# Altium schematic sheet USB_CP2104.SchDoc: CP2104 USB to Serial
size A4; Author: Andrés Gullón; DocumentNumber: 3; Revision: 1.G.3; SheetNumber: 3; SheetTotal: 6
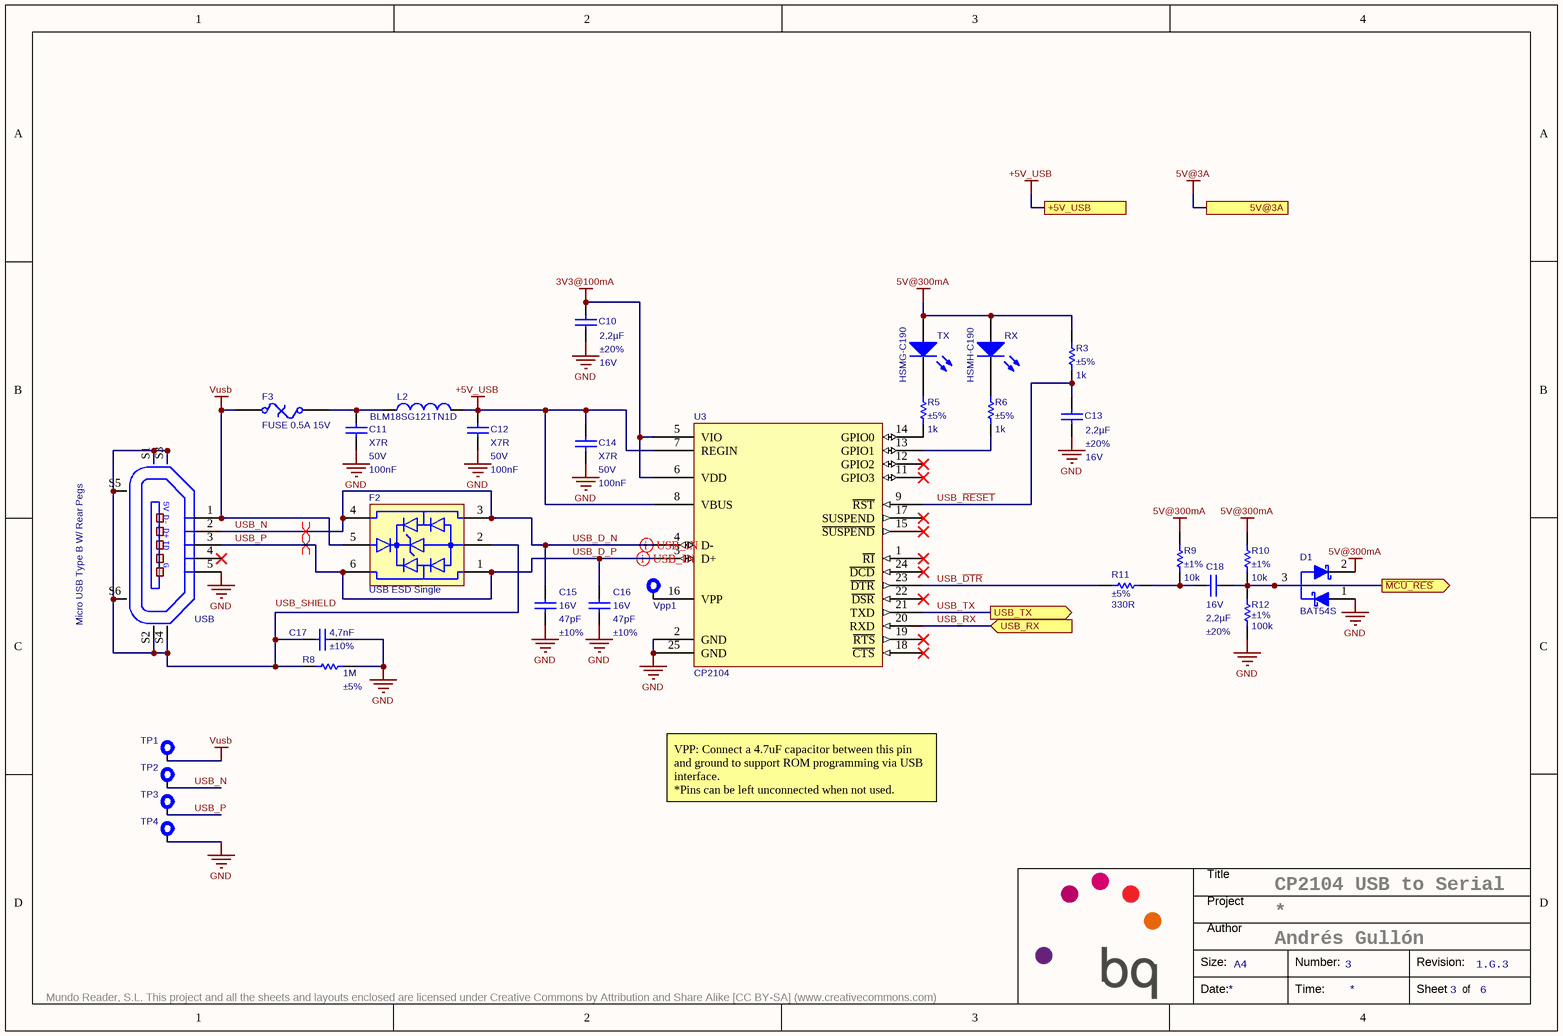
[diagram p0: USB_CP2104.SchDoc]

## Parts
C10  Voltage: 16V  Capacitance: 2,2µF  Tolerance: ±20%  [C0402]  (hidden comment: C0402_2.2uF_16V_±20%)
C11  Dielectric: X7R  Voltage: 50V  Capacitance: 100nF  [C0603]  (hidden comment: C0603_100nF_50V_±10%_X7R)
C12  Dielectric: X7R  Voltage: 50V  Capacitance: 100nF  [C0603]  (hidden comment: C0603_100nF_50V_±10%_X7R)
C13  Voltage: 16V  Capacitance: 2,2µF  Tolerance: ±20%  [C0402]  (hidden comment: C0402_2.2uF_16V_±20%)
C14  Dielectric: X7R  Voltage: 50V  Capacitance: 100nF  [C0603]  (hidden comment: C0603_100nF_50V_±10%_X7R)
C15  Voltage: 16V  Capacitance: 47pF  Tolerance: ±10%  [C0402]  (hidden comment: C0402_47pF_16V_±10%)
C16  Voltage: 16V  Capacitance: 47pF  Tolerance: ±10%  [C0402]  (hidden comment: C0402_47pF_16V_±10%)
C17  Capacitance: 4,7nF  Tolerance: ±10%  [C0805]  (hidden comment: C0805_4700pF_250V_±10%_X7R)
C18  Voltage: 16V  Capacitance: 2,2µF  Tolerance: ±20%  [C0402]  (hidden comment: C0402_2.2uF_16V_±20%)
D1  BAT54S  [SOT23-3]
F2  USB ESD Single  [SOT563]
F3  FUSE 0.5A 15V  [F1812]
L2  OrderingCode: BLM18SG121TN1D  [L0603]  (hidden comment: L0603_120R_0,025R_3000mA)
R3  Tolerance: ±5%  Resistance: 1k  [R0402]  (hidden comment: R0402_1k_0.063W_±5%)
R5  Tolerance: ±5%  Resistance: 1k  [R0402]  (hidden comment: R0402_1k_0.063W_±5%)
R6  Tolerance: ±5%  Resistance: 1k  [R0402]  (hidden comment: R0402_1k_0.063W_±5%)
R8  Tolerance: ±5%  Resistance: 1M  [R0603]  (hidden comment: R0603_1M_0.1W_±5%)
R9  Tolerance: ±1%  Resistance: 10k  [R0402]  (hidden comment: R0402_10k_0.063W_±1%)
R10  Tolerance: ±1%  Resistance: 10k  [R0402]  (hidden comment: R0402_10k_0.063W_±1%)
R11  Tolerance: ±5%  Resistance: 330R  [R0402]  (hidden comment: R0402_330R_0.063W_±5%)
R12  Tolerance: ±1%  Resistance: 100k  [R0402]  (hidden comment: R0402_100k_0.063W_±1%)
RX  HSMH-C190  [LED0603]
TP1  TP  [TP_POWER]  (value not drawn)  (no BOM)
TP2  TP_POWER  [TP_POWER]  (value not drawn)  (no BOM)
TP3  TP_POWER  [TP_POWER]  (value not drawn)  (no BOM)
TP4  TP_POWER  [TP_POWER]  (value not drawn)  (no BOM)
TX  HSMG-C190  [LED0603]
U3  CP2104  [QFN24_no_power]
USB  Micro USB Type B W/ Rear Pegs  [USB_B_W_REAR_PEGS]
Vpp1  TP_POWER  [TP_POWER]  (value not drawn)  (no BOM)

## Ports
5V@3A, +5V_USB, USB_RX (in), USB_TX (out), ~{MCU_RES} (out)

## Nets
3V3@100mA: C10.2 U3.5(VIO) U3.6(VDD)
5V@3A: port 5V@3A
5V@300mA: D1.2(K2) R3.2 R9.1 R10.1 RX.A TX.A
+5V_USB: C12.2 C14.2 L2.2 U3.7(REGIN) U3.8(VBUS) ; port +5V_USB
GND: C10.1 C11.1 C12.1 C13.1 C14.1 C15.1 C16.1 C17.2 D1.1(A) R8.1 R12.2 TP4.1 U3.2(GND) U3.25(GND) USB.5(P5)
Vusb: F2.5 F3.1 TP1.1 USB.1(P1)
~{MCU_RES}: C18.1 D1.3(K1) R10.2 R12.1 ; port ~{MCU_RES}
USB_~{DTR}: R11.1 U3.23(~{DTR})
USB_D_N: C15.2 F2.3 F2.4 TP2.1 U3.4(D-) USB.2(P2)  [also labelled USB_N]
USB_D_P: C16.2 F2.1 F2.6 TP3.1 U3.3(D+) USB.3(P3)  [also labelled USB_P]
USB_~{RESET}: C13.2 R3.1 U3.9(~{RST})
USB_RX: U3.20(RXD) ; port USB_RX
USB_TX: U3.21(TXD) ; port USB_TX
NetC11_2: C11.2 F3.2 L2.1
NetC17_1: C17.1 F2.2 R8.2 USB.S1(SHLD1) USB.S2(SHLD2) USB.S3(SHLD3) USB.S4(SHLD4) USB.S5(SHLD5) USB.S6(SHLD6)
NetC18_2: C18.2 R9.2 R11.2
NetR5_1: R5.1 U3.14(GPIO0)
NetR5_2: R5.2 TX.K
NetR6_1: R6.1 U3.13(GPIO1)
NetR6_2: R6.2 RX.K
NetU3_16: U3.16(VPP) Vpp1.1

Not connected (* = marked no-connect by the designer): U3 1(~{RI})* 11(GPIO3)* 12(GPIO2)* 15(~{SUSPEND})* 17(SUSPEND)* 18(~{CTS})* 19(~{RTS})* 22(~{DSR})* 24(~{DCD})*; USB 4(P4)*

## Layout directives
differential pair: USB_D_N, USB_D_P

## Notes on the sheet
- VPP: Connect a 4.7uF capacitor between this pin and ground to support ROM programming via USB interface.
  *Pins can be left unconnected when not used.
- Labels drawn without touching a wire or pin: USB_SHIELD
- Title
- Project
- Size:
- Author
- A4
- Number:
- Revision:
- Mundo Reader, S.L. This project and all the sheets and layouts enclosed are licensed under Creative Commons by Attribution and Share Alike [CC BY-SA] (www.creativecommons.com)
- Date:
- Time:
- Sheet
- of
- (in symbol CMP-A2224-4) 5V; D-; D+; ID; G

## Library data of the parts
C10 C13 C18 = CMP-A0550-4: C0402_2.2uF_16V_±20%_X5R; Part Number: C0402_2.2uF_16V_±10%; Manufacturer: TDK; Value: 2,2µF ±20% 16V; Dielectric: X5R; OrderingCode: C1005X5R1C225M050BC; Temp_ Max: 125; Temp_ Min: -55; AccessRights: 2147483647; ContentType: Component; Description ES: Condensador; Folder: Components Library\Pasives\Capacitor_SMD\C0402_16V$\; OrderingCode 2: EMK105ABJ225MV-F; RevisionId: 3; SchLibComponentName: Capacitor; Price units: EUR; ComponentType: Capacitor; ContentTypeGUID: CB3C11C4-E317-11DF-B822-12313F0024A2; FolderGUID: B1BE7916-43F7-4918-A273-F24409A7170B; ItemGUID: BD471B44-C1FF-4F80-85CC-AC0CC62DE9EE; ItemHRID: CMP-A0550; LifeCycle: New From Design; LifeCycleStateGUID: 706004B5-C76E-482E-903B-BA0E4FAE086A; Manufacturer 2: Taiyo Yuden; ReleaseDate: 04/09/2017 08:02:11 AM
C11 C12 C14 = CMP-00257-1: Manufacturer: Kemet; Description ES: Condensador; OrderingCode: C0603C104K5RAC; OrderingCode 2: 06035C104KAT2A; SchLibComponentName: Capacitor; Temp_ Max: 125; Temp_ Min: -55; Tolerance: ±10%; Value: 100nF ±10% 50V; Manufacturer 2: AVX; Part Number: C0603_100nF_50V_±10%_X7R; Price units: EUR
C15 C16 = CMP-A0572-2: Manufacturer: Kemet; Value: 47pF ±10% 16V; Dielectric: C0G; OrderingCode: C0402C470K4GAC; Temp_ Max: 125; Temp_ Min: -55; AccessRights: 2147483647; ContentType: Component; Description ES: Condensador; Folder: Components Library\Pasives\Capacitor_SMD\C0402_16V$\; RevisionId: 1; SchLibComponentName: Capacitor; Part Number: C0402_47pF_16V_±10%; Price units: EUR; ComponentType: Capacitor; ContentTypeGUID: CB3C11C4-E317-11DF-B822-12313F0024A2; FolderGUID: B1BE7916-43F7-4918-A273-F24409A7170B; ItemGUID: BA17F97B-A8F2-4344-A89B-4AB43394B9E9; ItemHRID: CMP-A0572; LifeCycle: New From Design; LifeCycleStateGUID: 706004B5-C76E-482E-903B-BA0E4FAE086A; ReleaseDate: 19/02/2016 10:21:00 AM
C17 = CMP-A0234-3: Manufacturer: TDK; Value: 4,7nF ±10% 250V; Dielectric: X7R; Voltage: 250V; OrderingCode: C2012X7R2E472K085AM; Temp_ Max: 125; Temp_ Min: -55; Description ES: Condensador; SchLibComponentName: Capacitor; Part Number: C0805_4700pF_250V_±10%; Price units: EUR
D1 = CMP-A2299-1: Schottky Diode; Manufacturer: NXP; SchLibComponentName: Dual Schottky; Ifor: 200mA; Vrrm: 30V; Ifsm: 600mA; Vf: 0,8V; Description ES: Diodo Schottky; Temp_Max: 150; Temp_Min: -55; Lead time: 8 wks; Value: 200mA 30V; Part Number: BAT54S; OrderingCode: BAT54S; Supplier cod: AC1190; Price units: EUR; Manufacturer 2: Vishay; OrderingCode 2: BAT54S
F2 = CMP-A2443-2: TVS Diode Array; Manufacturer: Würth Elektronik; OrderingCode: 82400152; Description ES: Array de diodos TVS; Temp_ Max: 125; Temp_ Min: -40; Lead time: 5 wks; OrderingCode 2: CDSOT563-0502; SchLibComponentName: ESDUSB; Part Number: USB ESD Single; Price units: EUR; Manufacturer 2: Bourns
F3 = CMP-A2421-1: Resettable Fuses; Manufacturer: Bourns; OrderingCode: MF-MSMF050-2; Description ES: Fusible reseteable; Temp_ Max: 85; Temp_ Min: -40; Lead time: 11 wks; SchLibComponentName: PTC_Fuse; Part Number: FUSE 0.5A 15V; Voltage: 15V; Current: 0.5A; Price units: EUR
L2 = CMP-A0708-2: Manufacturer: Murata; Resistance_100MHz: 120R; Resistance_DC: 0,025R; Current: 3000mA; Temp_ Max: 125; Temp_ Min: -55; Value: 120R 0,025R 3000mA; Description ES: Ferrita; SchLibComponentName: Ferrite Bead; Part Number: L0603_120R_0,025R_3000mA; Price units: EUR
R3 R5 R6 = CMP-A1718-3: Manufacturer: Vishay; OrderingCode: CRCW04021K00JN; Power: 0.063W; Value: 1k ±5% 0.063W; Temp_ Max: 155; Temp_ Min: -55; Description ES: Resistencia; SchLibComponentName: Resistor; PackageDescription: SMD; Part Number: R0402_1k_0.063W_±5%; Price units: EUR
R8 = CMP-A1358-3: Manufacturer: Vishay; OrderingCode: CRCW06031M00JN; Power: 0.1W; Value: 1M ±5% 0.1W; Temp_ Max: 155; Temp_ Min: -55; Description ES: Resistencia; SchLibComponentName: Resistor; PackageDescription: SMD; Part Number: R0603_1M_0.1W_±5%; Price units: EUR
R9 R10 = CMP-A1837-1: Manufacturer: Vishay; SchLibComponentName: Resistor; OrderingCode: CRCW040210K0FK; Power: 0.063W; Value: 10k ±1% 0.063W; Temp_ Max: 155; Temp_ Min: -55; PackageDescription: SMD; Part Number: R0402_10k_0.063W_±1%; Price units: EUR
R11 = CMP-A1762-2: Manufacturer: Vishay; OrderingCode: CRCW0402330RJN; Power: 0.063W; Value: 330R ±5% 0.063W; Temp_ Max: 155; Temp_ Min: -55; Description ES: Resistencia; SchLibComponentName: Resistor; PackageDescription: SMD; Part Number: R0402_330R_0.063W_±5%; Price units: EUR
R12 = CMP-A1835-2: Manufacturer: Vishay; Value: 100k ±1% 0.063W; SchLibComponentName: Resistor; OrderingCode: CRCW0402100KFK; Power: 0.063W; Temp_ Max: 155; Temp_ Min: -55; Description ES: Resistencia; PackageDescription: SMD; Part Number: R0402_100k_0.063W_±1%; Price units: EUR
RX = CMP-A2546-1: LED; Manufacturer: Avago Technologies; Temp_ Max: 85; Temp_ Min: -40; Lead time: 4 wks; OrderingCode 2: LS Q976-NR-1; Value: Red; SchLibComponentName: LED; Part Number: HSMH-C190; OrderingCode: HSMH-C190; Description ES: LED; Price units: EUR; Manufacturer 2: OSRAM Opto
TP1-TP4 Vpp1 = CMP-A2499-3: Testpoint 0.3mm; Manufacturer: Oxley; OrderingCode: SMOX/060/B1; SAP: 303552; SchLibComponentName: Testpoint; Part Number: TP_POWER; Price units: EUR
TX = CMP-A2544-1: LED; Manufacturer: Avago Technologies; Temp_ Max: 85; Temp_ Min: -40; Lead time: 5 wks; OrderingCode 2: LG Q971-KN-1; Value: Green; SchLibComponentName: LED; Part Number: HSMG-C190; OrderingCode: HSMG-C190; Description ES: LED; Price units: EUR; Manufacturer 2: OSRAM Opto
U3 = CMP-A2587-1: USB to UART Bridge; Manufacturer: Silicon Labs; OrderingCode: CP2104-F03-GMR; Description ES: Interfaz USB a UART; Temp_ Max: 85; Temp_ Min: -40; Lead time: 4 wks; SchLibComponentName: CP2104; Part Number: CP2104; Supplier cod: AC1190; Price units: EUR
USB = CMP-A2224-4: Manufacturer: FCI; OrderingCode: 10118194-0001LF; Description ES: Conector; Lead time: 10 wks; Temp_ Max: 105; Temp_ Min: -40; SchLibComponentName: USB_Micro_Type_B; Part Number: Micro USB Type B W/ Rear Pegs; Price units: EUR